# Altium schematic sheet POWER.schdoc
size 299 x 206 mm
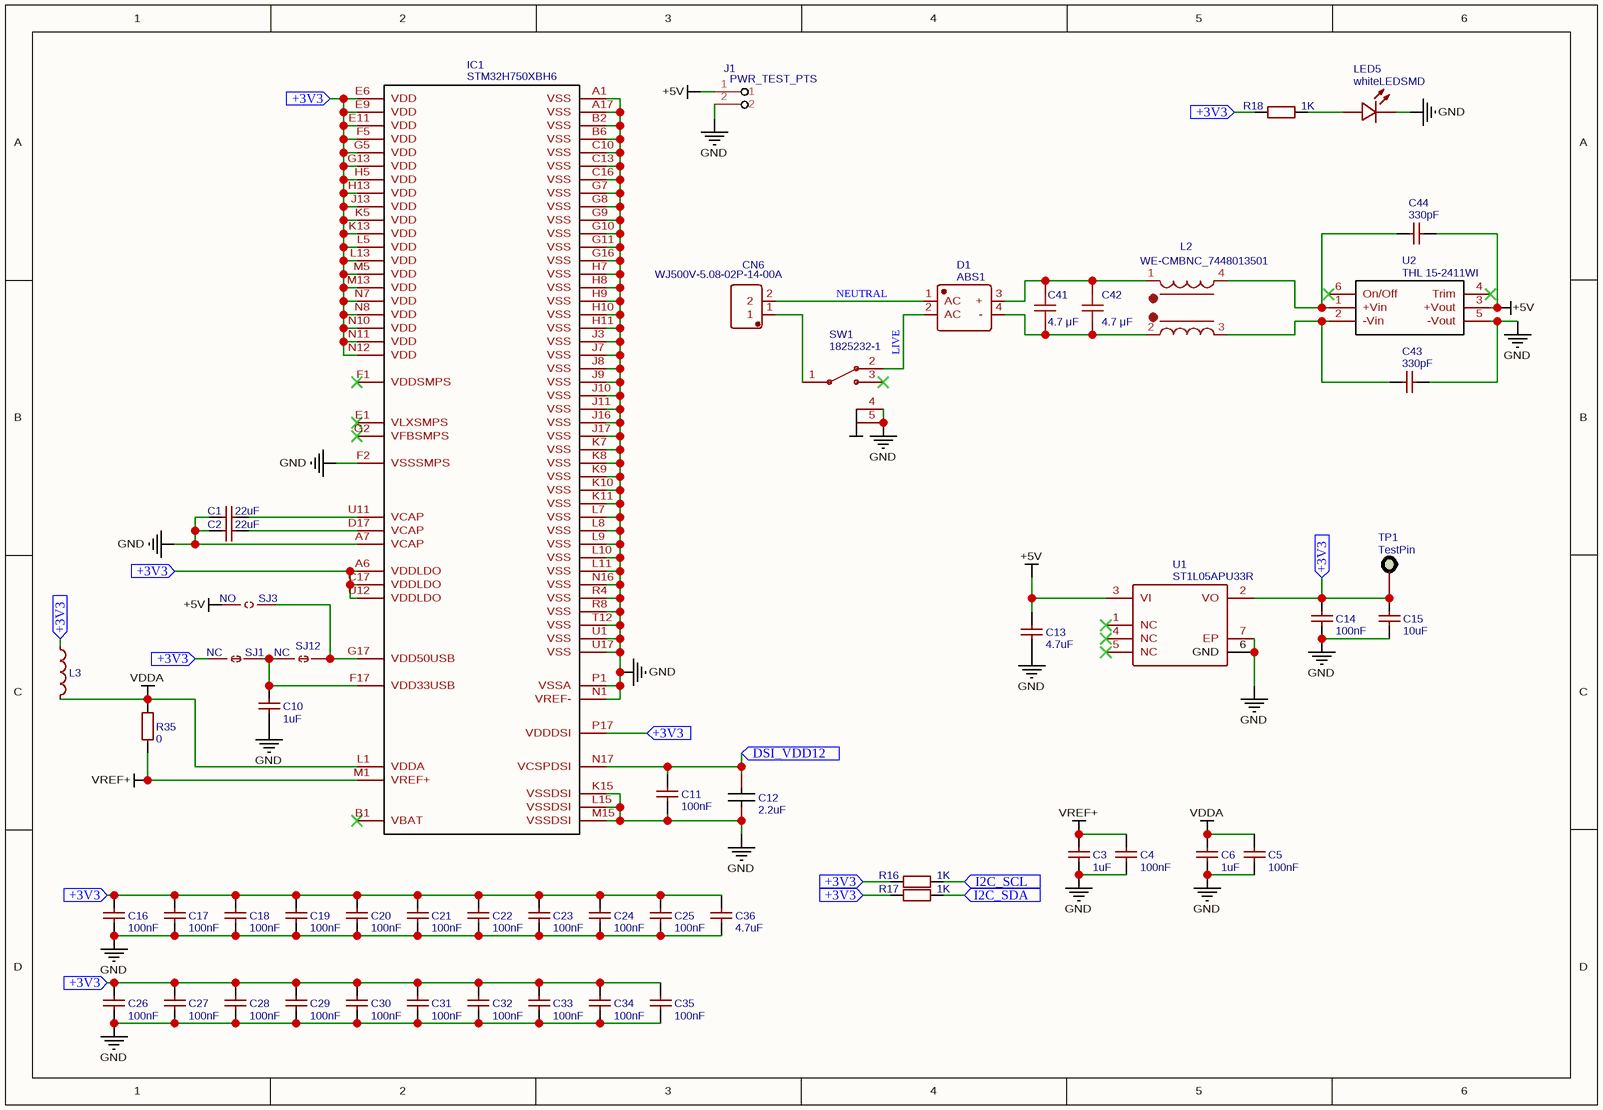
[diagram p0: POWER.schdoc]

## Parts
C1  22uF  [C1206]
C2  22uF  [C1206]
C3  1uF  [C0603]
C4  100nF  [C0402]
C5  100nF  [C0402]
C6  1uF  [C0603]
C10  1uF  [C0603]
C11  100nF  [C0402]
C12  2.2uF  [C0402]
C13  4.7uF  [C0402]
C14  100nF  [C0402]
C15  10uF  [C0805]
C16  100nF  [C0402]
C17  100nF  [C0402]
C18  100nF  [C0402]
C19  100nF  [C0402]
C20  100nF  [C0402]
C21  100nF  [C0402]
C22  100nF  [C0402]
C23  100nF  [C0402]
C24  100nF  [C0402]
C25  100nF  [C0402]
C26  100nF  [C0402]
C27  100nF  [C0402]
C28  100nF  [C0402]
C29  100nF  [C0402]
C30  100nF  [C0402]
C31  100nF  [C0402]
C32  100nF  [C0402]
C33  100nF  [C0402]
C34  100nF  [C0402]
C35  100nF  [C0402]
C36  4.7uF  [C0402]
C41  4.7 μF  [C0805]
C42  4.7 μF  [C0805]
C43  330pF  [C1206]
C44  330pF  [C1206]
CN6  WJ500V-5.08-02P-14-00A  [CONN-TH_2P-P5.08-WJ500V-5.08-2P]
D1  ABS1  [ABS_L5.3-W4.6-P4.00-LS6.8-TL]
IC1  STM32H750XBH6  [BGA265C80P17X17_1400X1400X110]
J1  PWR_TEST_PTS  [JUMPER]
L2  WE-CMBNC_7448013501  [WE-CMBNC_XS_744801XXXX]
L3  FCM1608KF-601T03  [L0603]  (value not drawn)
LED5  whiteLEDSMD  [LED-0805]
R16  1K  [R0402]
R17  1K  [R0402]
R18  1K  [R0402]
R35  0  [R0402]
SJ1  NC  [PAD-JUMPER-2-NC_BY_TRACE_YES_SILK]
SJ3  NO  [PAD-JUMPER-2-NO_YES_SILK]
SJ12  NC  [PAD-JUMPER-2-NC_BY_TRACE_YES_SILK]
SW1  1825232-1  [1825232-1]
TP1  TestPin  [TESTPIN]
U1  ST1L05APU33R  [DFN6D]
U2  THL 15-2411WI  [THL 15-2411WI]

## Ports
+3V3 (in), DSI_VDD12 (in), I2C_SCL (in), I2C_SDA (in)

## Nets
+5V: C13.2 C44.2 J1.1 SJ3.1 U1.3(VI) U2.3(+Vout)
GND: C1.1 C2.1 C3.1 C4.1 C5.1 C6.1 C10.1 C11.1 C12.1 C13.1 C14.1 C15.1 C16.1 C17.1 C18.1 C19.1 C20.1 C21.1 C22.1 C23.1 C24.1 C25.1 C26.1 C27.1 C28.1 C29.1 C30.1 C31.1 C32.1 C33.1 C34.1 C35.1 C36.1 C43.2 IC1.A1(VSS) IC1.A7(VCAP) IC1.A17(VSS) IC1.B2(VSS) IC1.B6(VSS) IC1.C10(VSS) IC1.C13(VSS) IC1.C16(VSS) IC1.F2(VSSSMPS) IC1.G7(VSS) IC1.G8(VSS) IC1.G9(VSS) IC1.G10(VSS) IC1.G11(VSS) IC1.G16(VSS) IC1.H7(VSS) IC1.H8(VSS) IC1.H9(VSS) IC1.H10(VSS) IC1.H11(VSS) IC1.J3(VSS) IC1.J7(VSS) IC1.J8(VSS) IC1.J9(VSS) IC1.J10(VSS) IC1.J11(VSS) IC1.J16(VSS) IC1.J17(VSS) IC1.K7(VSS) IC1.K8(VSS) IC1.K9(VSS) IC1.K10(VSS) IC1.K11(VSS) IC1.K15(VSSDSI) IC1.L7(VSS) IC1.L8(VSS) IC1.L9(VSS) IC1.L10(VSS) IC1.L11(VSS) IC1.L15(VSSDSI) IC1.M15(VSSDSI) IC1.N1(VREF-) IC1.N16(VSS) IC1.P1(VSSA) IC1.R4(VSS) IC1.R8(VSS) IC1.T12(VSS) IC1.U1(VSS) IC1.U17(VSS) J1.2 LED5.2(K) SW1.4 SW1.5 U1.6(GND) U1.7(EP) U2.5(-Vout)
VDDA: C5.2 C6.2 IC1.L1(VDDA) L3.2 R35.2
VREF+: C3.2 C4.2 IC1.M1(VREF+) R35.1
+3V3: C14.2 C15.2 C16.2 C17.2 C18.2 C19.2 C20.2 C21.2 C22.2 C23.2 C24.2 C25.2 C26.2 C27.2 C28.2 C29.2 C30.2 C31.2 C32.2 C33.2 C34.2 C35.2 C36.2 IC1.A6(VDDLDO) IC1.C17(VDDLDO) IC1.E6(VDD) IC1.E9(VDD) IC1.E11(VDD) IC1.F5(VDD) IC1.G5(VDD) IC1.G13(VDD) IC1.H5(VDD) IC1.H13(VDD) IC1.J13(VDD) IC1.K5(VDD) IC1.K13(VDD) IC1.L5(VDD) IC1.L13(VDD) IC1.M5(VDD) IC1.M13(VDD) IC1.N7(VDD) IC1.N8(VDD) IC1.N10(VDD) IC1.N11(VDD) IC1.N12(VDD) IC1.P17(VDDDSI) IC1.U12(VDDLDO) L3.1 R16.1 R17.1 R18.1 SJ1.1 TP1.1 U1.2(VO) ; port +3V3
DSI_VDD12: C11.2 C12.2 IC1.N17(VCSPDSI) ; port DSI_VDD12
I2C_SCL: R16.2 ; port I2C_SCL
I2C_SDA: R17.2 ; port I2C_SDA
LIVE: D1.2(AC) SW1.2
NEUTRAL: CN6.2 D1.1(AC)
NetC1_2: C1.2 IC1.U11(VCAP)
NetC2_2: C2.2 IC1.D17(VCAP)
NetC10_2: C10.2 IC1.F17(VDD33USB) SJ1.2 SJ12.1
NetC41_1: C41.1 C42.1 D1.4(-) L2.2
NetC41_2: C41.2 C42.2 D1.3(+) L2.1
NetC43_1: C43.1 L2.3 U2.2(-Vin)
NetC44_1: C44.1 L2.4 U2.1(+Vin)
NetCN6_1: CN6.1 SW1.1
NetIC1_G17: IC1.G17(VDD50USB) SJ3.2 SJ12.2
NetLED5_1: LED5.1(A) R18.2

Not connected (* = marked no-connect by the designer): IC1 B1(VBAT)* E1(VLXSMPS)* F1(VDDSMPS)* G2(VFBSMPS)*; SW1 3*; U1 1(NC)* 4(NC)* 5(NC)*; U2 4(Trim)* 6(On/Off)*

## Library data of the parts
C1 C2 = 22uF: BOM_Manufacturer Part: CL31A226KPHNNNE; BOM_Manufacturer: SAMSUNG; nameAlias: Capacitance; SMT Type: Extend; BOM_Supplier: LCSC; BOM_Supplier Part: C5672; BOM_JLCPCB SMD: Yes; spicePre: C; spiceSymbolName: CL31A226KPHNNNE
C3 C6 C10 = 1uF: BOM_Manufacturer Part: CL10A105KB8NNNC; BOM_Manufacturer: SAMSUNG; nameAlias: Capacitance; SMT Type: Basic; BOM_Supplier: LCSC; BOM_Supplier Part: C15849; BOM_JLCPCB SMD: Yes; spicePre: C; spiceSymbolName: CL10A105KB8NNNC
C4 C5 C11 C14 C16-C35 = 100nF: BOM_Manufacturer Part: CL05B104KO5NNNC; BOM_Manufacturer: SAMSUNG; nameAlias: Capacitance; SMT Type: Basic; BOM_Supplier: LCSC; BOM_Supplier Part: C1525; BOM_JLCPCB SMD: Yes; spicePre: C; spiceSymbolName: CL05B104KO5NNNC
C12 = 2.2uF: BOM_Manufacturer Part: CL05A225MQ5NSNC; BOM_Manufacturer: SAMSUNG; nameAlias: Capacitance; SMT Type: Extend; BOM_Supplier: LCSC; BOM_Supplier Part: C12530; BOM_JLCPCB SMD: Yes; spicePre: C; spiceSymbolName: CL05A225MQ5NSNC
C13 C36 = 4.7uF: BOM_Manufacturer Part: CL05A475MP5NRNC; BOM_Manufacturer: SAMSUNG; nameAlias: Capacitance; SMT Type: Basic; BOM_Supplier: LCSC; BOM_Supplier Part: C23733; BOM_JLCPCB SMD: Yes; spicePre: C; spiceSymbolName: CL05A475MP5NRNC
C15 = 10uF: BOM_Manufacturer Part: CL21A106KAYNNNE; BOM_Manufacturer: SAMSUNG; nameAlias: Capacitance; SMT Type: Basic; BOM_Supplier: LCSC; BOM_Supplier Part: C15850; BOM_JLCPCB SMD: Yes; spicePre: C; spiceSymbolName: CL21A106KAYNNNE
C41 C42 = 4.7 μF: BOM_Manufacturer: Samsung Electro-Mechanics; nameAlias: Value; Contributor: LCSC; BOM_Supplier: LCSC; BOM_Supplier Part: C16036; BOM_Manufacturer Part: -; spicePre: C; spiceSymbolName: 4.7nF(472) ±10% 50V
C43 C44 = 330pF: BOM_Manufacturer: FH; BOM_Manufacturer Part: 1206B331K501NT; nameAlias: Capacitance; BOM_Supplier: LCSC; BOM_Supplier Part: C46377; spicePre: C; spiceSymbolName: 1206B331K501NT
CN6 = WJ500V-5.08-02P-14-00A: BOM_Manufacturer: ReliaPro; Contributor: LCSC; BOM_Supplier: LCSC; BOM_Manufacturer Part: WJ500V-5.08-02P-14-00A; BOM_Supplier Part: C138464; spicePre: C; spiceSymbolName: WJ500V-5.08-02P-14-00A
D1 = ABS1: BOM_Manufacturer: SK; Contributor: LCSC; SMT Type: Extend; BOM_Supplier: LCSC; BOM_Manufacturer Part: ABS1; BOM_Supplier Part: C130890; BOM_JLCPCB SMD: Yes; spicePre: D; spiceSymbolName: ABS1
IC1 = STM32H750XBH6: subpart_no: 1; Contributor: Ke'Ondrae_Mell; spicePre: I; spiceSymbolName: STM32H750XBH6
J1 = PWR_TEST_PTS: Contributor: Claudio Quartarone; spicePre: J; spiceSymbolName: jumper
L2 = WE-CMBNC_7448013501: description: WE-CMBNC Common Mode Power Line Choke Nanocrystalline; timeStamp: 1469625483; spicePre: L; spiceSymbolName: WE-CMBNC_7448013501
L3 = FCM1608KF-601T03: BOM_Manufacturer: TAITEC; Contributor: LCSC; Package Display: No; BOM_Supplier: LCSC; BOM_Supplier Part: C141723; BOM_Manufacturer Part: FCM1608KF-601T03; spicePre: L; spiceSymbolName: FCM1608KF-601T03
LED5 = whiteLEDSMD: BOM_Manufacturer: KENTO; SMT Type: Basic; BOM_Supplier: LCSC; BOM_Manufacturer Part: whiteLEDSMD; BOM_LCSC Assembly: Yes; image: //image.lceda.cn/szlcsc/C34499.jpg; BOM_Supplier Part: C34499; spicePre: L; spiceSymbolName: whiteLEDSMD
R16-R18 = 1K: BOM_Manufacturer: UniOhm; BOM_Manufacturer Part: 0402WGF1001TCE; nameAlias: Resistance (Ohms); SMT Type: Basic; BOM_Supplier: LCSC; BOM_Supplier Part: C11702; BOM_JLCPCB SMD: Yes; spicePre: R; spiceSymbolName: 0402WGF1001TCE
R35 = 0: BOM_Manufacturer: KOA; BOM_Manufacturer Part: RK73Z1ETTP; nameAlias: Resistance (Ohms); BOM_Supplier: LCSC; BOM_Supplier Part: C131359; spicePre: R; spiceSymbolName: RK73Z1ETTP
SJ1 SJ12 = NC: Contributor: SparkFun; spicePre: S; spiceSymbolName: JUMPER-PAD-2-NC_BY_TRACE
SJ3 = NO: Contributor: SparkFun; spicePre: S; spiceSymbolName: JUMPER-PAD-2-NOYES_SILK
SW1 = 1825232-1: BOM_Manufacturer: TE Connectivity / P&B; Contributor: nathantct; BOM_Supplier Part: 655-1825232-1; BOM_Supplier: Mouser; link: https://www.mouser.fr/ProductDetail/TE-Connectivity-PB/1825232-1?qs=kTKVN3NWb5FosGxaNC1%252BtA%3D%3D; spicePre: S; spiceSymbolName: 1825232-1
TP1 = TestPin: Contributor: alan.green; sourceId: WTb5nFXR9; timeStamp: 1460711565; spicePre: T; spiceSymbolName: TestPin
U1 = ST1L05APU33R: description: Very Low Quiescent BiCMOS Voltage Regulator, 3.3V, 6-Pin VFDFPN, Tape and Reel; spicePre: U; spiceSymbolName: ST1L05APU33R
U2 = THL 15-2411WI: BOM_Manufacturer: Traco Power; Contributor: louis.grueninger; BOM_Manufacturer Part: THL 15-2411WI; BOM_Supplier: Digi-Key; BOM_Supplier Part: 1951-3321-ND; link: https://www.digikey.com/product-detail/en/traco-power/THL-15-2411WI/1951-3321-ND/9998470; spicePre: U; spiceSymbolName: TL 15-2411WI